# EAGLE design biosense_bgm220-pcbcart-cc-bma-flex-05212021 (EAGLE 9.3.1)
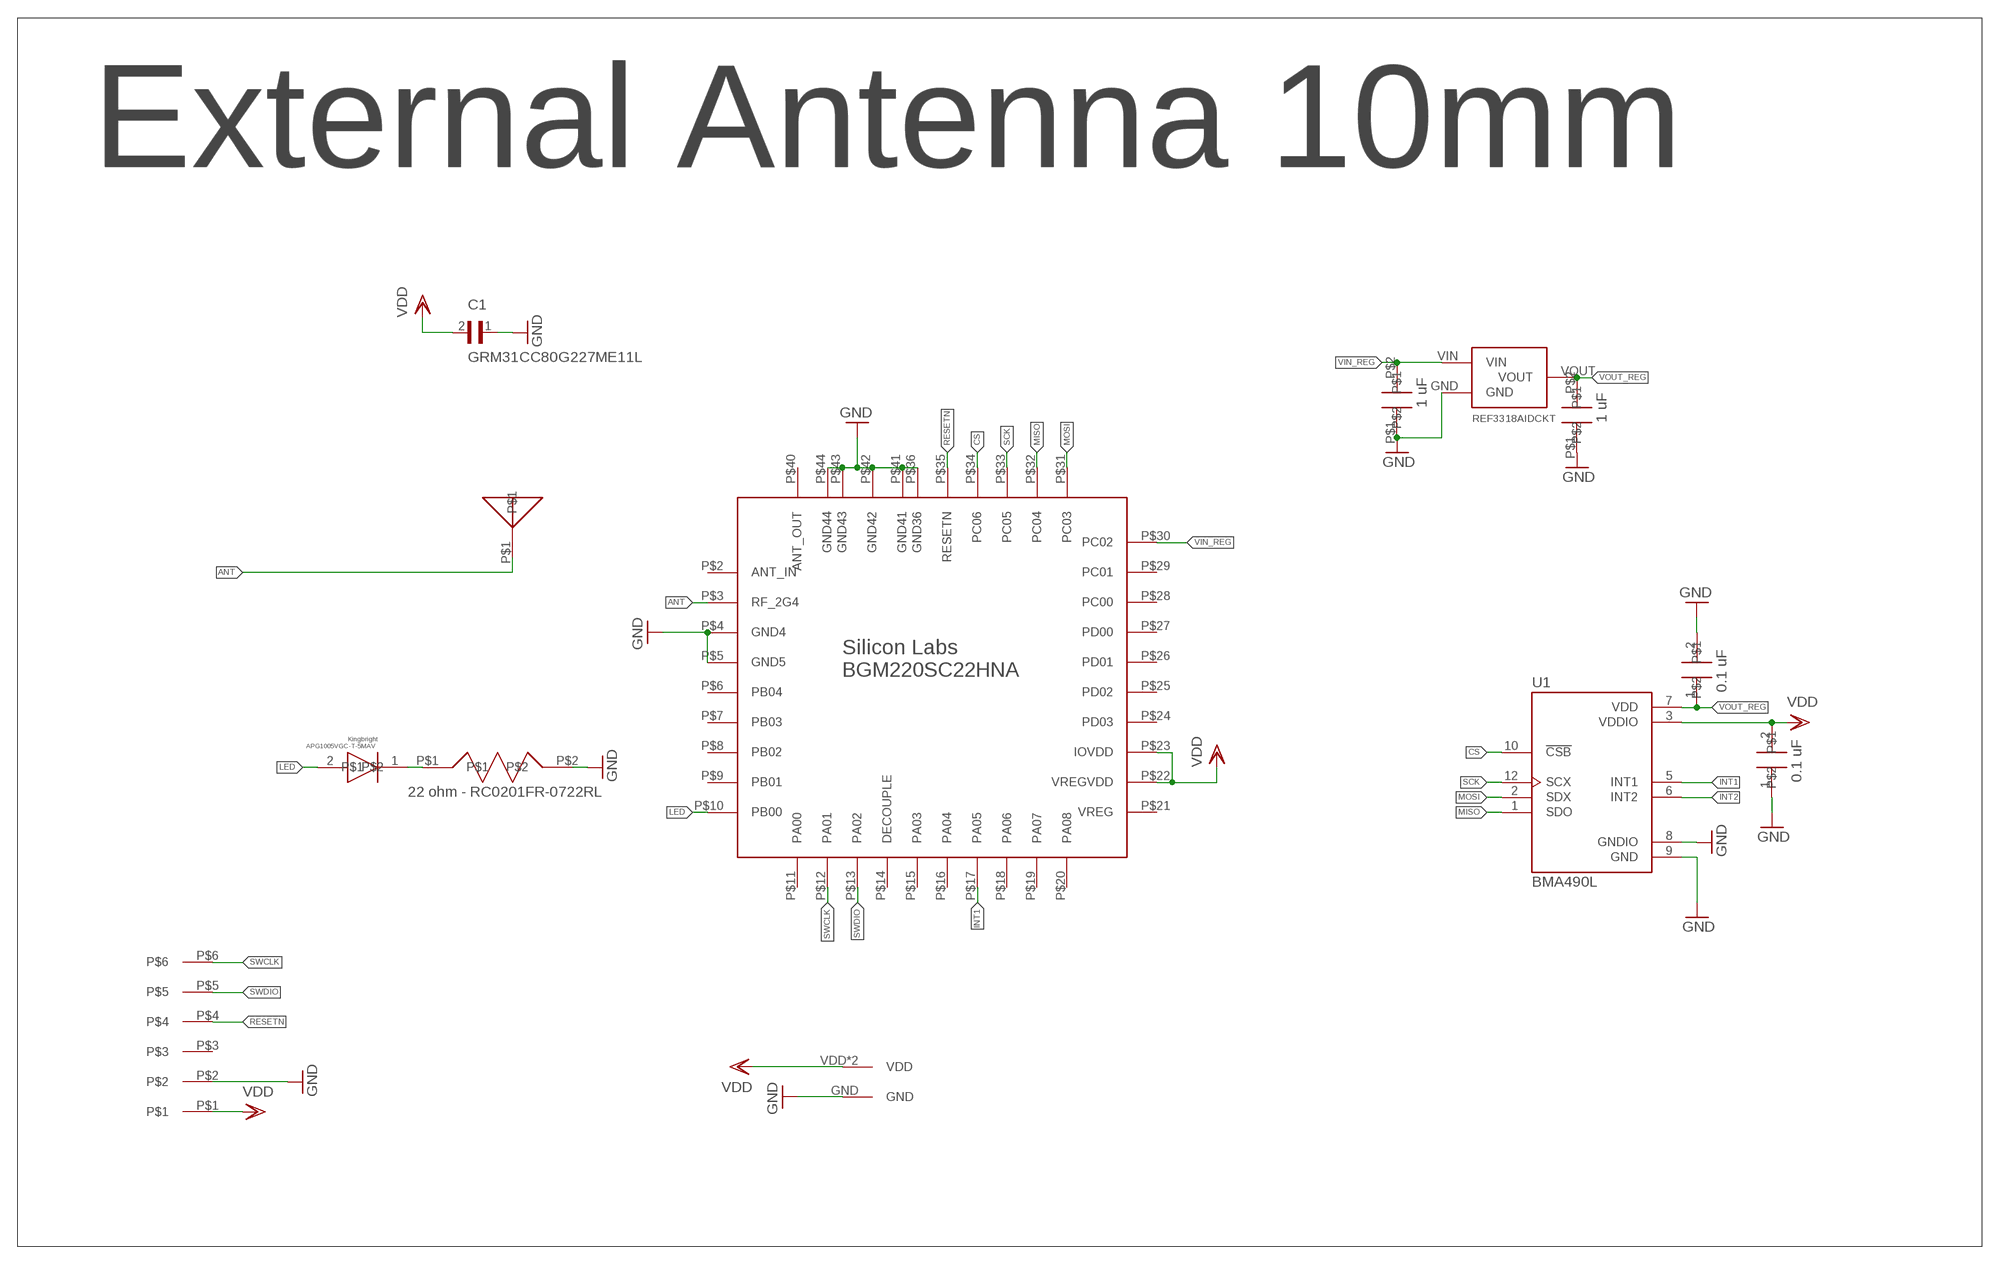
[diagram p0: schematic, sheet 1]

## Parts
C1  GRM31CC80G227ME11L  [CAP3216X125N]
R1  LEDRC0402N-L  [RC0402N-L]
U1  BMA490L  [BMA490L]
U$1  BGM220SC22HNA  [BGM220SC22HNA]
U$2  0U1_CAPACITOR  [FOOTPRINT_01005]
U$3  0U1_CAPACITOR  [FOOTPRINT_01005]
U$4  FPCHEADER  [FPCHEADER]
U$5  2450AT18A100  [2450AT18A100]
U$6  REF3318  [SOT-SC70]
U$7  CR1025HOLDERCR1025_3  [CR1025_3]
U$9  1U_CAPACITOR  [FOOTPRINT_0201]
U$10  1U_CAPACITOR  [FOOTPRINT_0201]
U$25  22OHMRESISTOR  [FOOTPRINT_0201]

## Nets
ANT: U$1.P$3(RF_2G4) U$5.P$1
CS: U1.10(!CSB) U$1.P$34(PC06)
GND: C1.1 U1.8(GNDIO) U1.9(GND) U$1.P$4(GND4) U$1.P$5(GND5) U$1.P$36(GND36) U$1.P$41(GND41) U$1.P$42(GND42) U$1.P$43(GND43) U$1.P$44(GND44) U$2.1 U$3.2 U$4.P$2 U$6.GND U$7.GND U$9.P$1 U$10.P$1 U$25.P$2
INT1: U1.5(INT1) U$1.P$17(PA05)
INT2: U1.6(INT2)
LED: R1.2 U$1.P$10(PB00)
MISO: U1.1(SDO) U$1.P$32(PC04)
MOSI: U1.2(SDX) U$1.P$31(PC03)
N$6: R1.1 U$25.P$1
RESETN: U$1.P$35(RESETN) U$4.P$4
SCK: U1.12(SCX) U$1.P$33(PC05)
SWCLK: U$1.P$12(PA01) U$4.P$6
SWDIO: U$1.P$13(PA02) U$4.P$5
VDD: C1.2 U1.3(VDDIO) U$1.P$22(VREGVDD) U$1.P$23(IOVDD) U$2.2 U$4.P$1 U$7.VDD U$7.VDD2(VDD)
VIN_REG: U$1.P$30(PC02) U$6.VIN U$9.P$2
VOUT_REG: U1.7(VDD) U$3.1 U$6.VOUT U$10.P$2
Unconnected: U$1.P$2(ANT_IN) U$1.P$6(PB04) U$1.P$7(PB03) U$1.P$8(PB02) U$1.P$9(PB01) U$1.P$11(PA00) U$1.P$14(DECOUPLE) U$1.P$15(PA03) U$1.P$16(PA04) U$1.P$18(PA06) U$1.P$19(PA07) U$1.P$20(PA08) U$1.P$21(VREG) U$1.P$24(PD03) U$1.P$25(PD02) U$1.P$26(PD01) U$1.P$27(PD00) U$1.P$28(PC00) U$1.P$29(PC01) U$1.P$40(ANT_OUT) U$4.P$3

## Notes on the sheet
- External Antenna 10mm

## Library data of the parts
C1 = BGM220S:GRM31CC80G227ME11L: CAP CER 220UF 4V X6S 1206; DESCRIPTION: 220µF ±20% 4V Ceramic Capacitor X6S 1206 _3216 Metric_; DIGI-KEY_PART_NUMBER: 490-13250-1-ND; DIGI-KEY_PURCHASE_URL: https://www.digikey.com/product-detail/en/murata-electronics/GRM31CC80G227ME11L/490-13250-1-ND/5877458?utm_source=snapeda&utm_medium=aggregator&utm_campaign=symbol; MF: Murata Electronics; MP: GRM31CC80G227ME11L; PACKAGE: 1206 Murata
R1 = BGM220S:LED; MANUFACTURER_PART_NUMBER: CRCW04020000Z0ED; VENDOR: Vishay
U1 = BGM220S:BMA490L: Ultra low power, 12-bit digital triaxial accelerometer; AVAILABILITY: Unavailable; DESCRIPTION: Accelerometer X, Y, Z Axis ±2g, 4g, 8g, 16g 12-LGA (2x2); MF: Bosch Sensortec; MP: BMA400; PACKAGE: LGA-12 Bosch Tools; PRICE: None
U$1 = BGM220S:BGM220SC22HNA: BGM220SC22HNA EFR32BG22 Series 2 Modules
U$2 U$3 = BGM220S:0U1_CAPACITOR: Murata Electronics GRM022R60J104KE15L 0.1μF ±10% 6.3V Ceramic Capacitor X5R 01005
U$4 = BGM220S:FPCHEADER
U$5 = BGM220S:2450AT18A100
U$6 = BGM220S:REF3318
U$7 = BGM220S:CR1025HOLDER
U$9 U$10 = BGM220S:1U_CAPACITOR: Samsung Electro-Mechanics CL03A105KQ3CSNC 1μF ±10% 6.3V Ceramic Capacitor X5R 0201
U$25 = BGM220S:22OHMRESISTOR: RC0201FR-0722RL

## Board
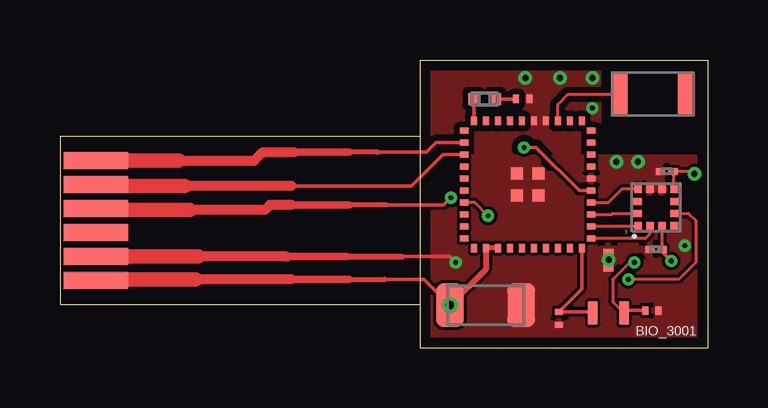
[diagram p1: board, top side]
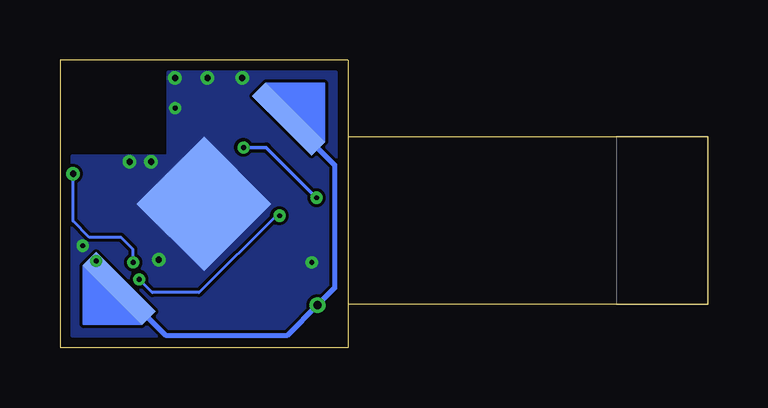
[diagram p2: board, bottom side, seen from below]

Size 27 x 12 mm. Coordinates in mm from the lower left corner, seen from the top.
Outline: 15,8.8 15,12 27,12 27,0 15,0 15,1.8
Outline: 15,8.8 0,8.8 0,1.8 15,1.8
Outline: 15,8.8 15,1.8
Copper layers (1*16): Top 0.035mm / dielectric 0.07mm / Bottom 0.035mm
Design rules "pcbcart_10-17-2020 *": minimum track width 5mil, minimum drill 0.2mm, track to track 5mil, track to pad 5mil, pad to pad 5mil, via to via 5mil, smd to smd 5mil, copper to edge 10mil, drill to drill 20mil, minimum pad ring 6mil, minimum via ring 6mil, stop-mask expansion 1mil, vias tented up to drill 50mil, thermal gap 10mil

### Footprints (pad centres in the part's own frame; a part is rotated, then mirrored left to right if it is on the bottom)
CAP3216X125N = smd 1.15 x 1.82: 1 -1.485,0; 2 1.485,0
RC0402N-L = smd 0.452 x 0.5: 1 -0.451,0; 2 0.451,0
BMA490L = smd 0.35 x 0.3: 1 -0.775,0.75; 2 -0.775,0.25; 3 -0.775,-0.25; 4 -0.775,-0.75; 7 0.775,-0.75; 8 0.775,-0.25; 9 0.775,0.25; 10 0.775,0.75 | smd 0.3 x 0.35: 5 -0.25,-0.775; 6 0.25,-0.775; 11 0.25,0.775; 12 -0.25,0.775
BGM220SC22HNA = smd 0.35 x 0.25: P$1 0,0; P$2 0,-0.5; P$3 0,-1; P$4 0,-1.5; P$5 0,-2; P$6 0,-2.5; P$7 0,-3; P$8 0,-3.5; P$9 0,-4; P$10 0,-4.5; P$21 5.3,-4.5; P$22 5.3,-4; P$23 5.3,-3.5; P$24 5.3,-3; P$25 5.3,-2.5; P$26 5.3,-2; P$27 5.3,-1.5; P$28 5.3,-1; P$29 5.3,-0.5; P$30 5.3,0 | smd 0.25 x 0.35: P$11 0.4,-4.9; P$12 0.9,-4.9; P$13 1.4,-4.9; P$14 1.9,-4.9; P$15 2.4,-4.9; P$16 2.9,-4.9; P$17 3.4,-4.9; P$18 3.9,-4.9; P$19 4.4,-4.9; P$20 4.9,-4.9; P$31 4.9,0.4; P$32 4.4,0.4; P$33 3.9,0.4; P$34 3.4,0.4; P$35 2.9,0.4; P$36 2.4,0.4; P$37 1.9,0.4; P$38 1.4,0.4; P$39 0.9,0.4; P$40 0.4,0.4 | smd 0.5 x 0.5: P$41 2.2,-1.8; P$42 2.2,-2.7; P$43 3.1,-2.7; P$44 3.1,-1.8
FOOTPRINT_01005 = smd 0.379 x 0.299: 1 -0.261,0; 2 0.261,0
FPCHEADER = smd 0.71 x 2.7: P$1 0,0; P$2 1,0; P$3 2,0; P$4 3,0; P$5 4,0; P$6 5,0
2450AT18A100 = smd 0.7 x 1.8: P$1 0.3,0.9; P$2 3.1,0.9
SOT-SC70 = smd 0.95 x 0.4: GND 2.2,0.65; VIN 0,1.3; VOUT 0,0
CR1025_3 = smd 3.96 x 3.96: GND 0,0 | smd 0.8 x 3.5: VDD -5,0; VDD2 5,0
FOOTPRINT_0201 = smd 0.25 x 0.35: P$1 0,0; P$2 0.55,0

### Placement (x,y rotation side)
C1  17.75,1.77 180 top
R1  17.7,10.37 180 top
U1  24.85,5.85 90 top
U$1  21.75,9.45 270 top
U$2  24.85,4.1 0 top
U$3  25.3,7.35 180 top
U$4  1.5,2.8 90 top
U$5  23.01,9.67 0 top
U$6  23.51,1.45 90 top
U$7  21,6 45 bottom
U$9  20.8,0.95 90 top
U$10  24.95,1.55 180 top
U$25  19.02,10.37 0 top

### Tracks (layer width: path | path; a pad name or v marks a point on that pad's centre or on a via)
ANT
  Top 0.127: U$1.P$3 20.75,10.14 21.18,10.57 U$5.P$1
CS
  Top 0.127: U1.10 23.43,6.62 22.86,6.05 U$1.P$34
GND  (via drill 0.2, 0.25)
  Top 0.152: 14.25,3.8 16.25,3.8 v16.5,3.55
  Top 0.254: 11.95,3.8 14.25,3.8
  Top 0.305: 11.95,3.8 9.45,3.8
  Top 0.406: 9.45,3.8 5.75,3.8
  Top 0.61: 5.75,3.8 U$4.P$2
  other vias: 19.4,11.25 20.85,11.25 22.2,11.25 22.2,9.99 24.1,7.75 23.2,7.75 22.88,3.67 26.05,4.25
  pour Top (isolate 0.254, no thermals): 15.5,0.5 15.5,11.5 22.5,11.5 22.5,8 26.5,8 26.5,0.5
  pour Bottom (no thermals): 15.5,0.5 15.5,11.5 22.5,11.5 22.5,8 26.5,8 26.5,0.5
  pour Top: 26.5,8 26.5,0.5 26.35,0.5 15.5,0.5 15.5,8
INT1  (via drill 0.2)
  Top 0.127: U1.5 26.2,5.6 26.5,5.3 26.5,3.55 25.8,2.85 v23.7,2.85 | U$1.P$17 17.3,6.05 v17.85,5.5
  Bottom 0.127: v17.85,5.5 18,5.5 21.2,2.3 23.15,2.3 v23.7,2.85
LED
  Top 0.152: U$1.P$10 R1.2
MISO
  Top 0.127: U1.1 24.08,5.05 U$1.P$32
MOSI
  Top 0.127: U1.2 24.6,4.75 24.4,4.55 U$1.P$31
N$6
  Top 0.152: R1.1 U$25.P$1
RESETN  (via drill 0.2)
  Top 0.152: U$1.P$35 21.65,6.55 19.85,8.35 v19.35,8.35 | v16.3,6.25 16,5.95 13.6,5.95
  Top 0.203: 13.6,5.95 12.05,5.95
  Top 0.305: 12.05,5.95 9.65,5.95
  Top 0.406: 9.65,5.95 8.75,5.95 8.55,5.75 5.4,5.75
  Top 0.61: 5.4,5.75 1.55,5.75 U$4.P$4
  Bottom 0.152: v16.3,6.25 18.4,8.35 v19.35,8.35
SCK
  Top 0.127: U$1.P$33 23,5.55 23.05,5.6 U1.12
SWCLK
  Top 0.152: U$1.P$12 15.68,8.55 15.28,8.15 13.25,8.15
  Top 0.203: 13.25,8.15 12.05,8.15
  Top 0.305: 9.75,8.15 12.05,8.15
  Top 0.406: 4.95,7.8 8.1,7.8 8.45,8.15 9.75,8.15
  Top 0.61: U$4.P$6 4.95,7.8
SWDIO
  Top 0.152: U$1.P$13 15.96,8.05 14.66,6.75 9.65,6.75
  Top 0.406: 9.65,6.75 5.2,6.75
  Top 0.61: 5.2,6.75 1.55,6.75 U$4.P$5
VDD  (via drill 0.2, 0.35)
  Top 0.127: U1.3 U$2.2
  Top 0.152: 13.55,2.85 15.19,2.85 C1.2 | U$2.2 25.11,3.99 v25.49,3.61
  Top 0.203: U$1.P$23 U$1.P$22 | 12.05,2.85 13.55,2.85
  Top 0.254: U$1.P$22 17.75,3.26 C1.2
  Top 0.305: 12.05,2.85 9.65,2.85
  Top 0.406: 9.65,2.85 5.65,2.85
  Top 0.61: 5.65,2.85 1.55,2.85 U$4.P$1
  Bottom 0.152: U$7.VDD 25.49,3.42 v25.49,3.61
  Bottom 0.203: U$7.VDD 22.57,0.5 17.54,0.5 C1.2 15.55,2.48 15.55,7.62 U$7.VDD2
  other vias: 16.26,1.77
VIN_REG
  Top 0.152: U$1.P$30 21.75,2.45 U$9.P$2 22.16,1.5 U$6.VIN
VOUT_REG  (via drill 0.2, 0.25)
  Top 0.127: U1.7 25.6,7.31 U$3.1 26.35,7.35 v26.45,7.25 | v23.95,3.55 23.75,3.55 23.05,2.85 23.05,1.91 U$6.VOUT
  Top 0.152: U$10.P$2 23.62,1.55 U$6.VOUT
  Bottom 0.127: v23.95,3.55 23.95,4.1 24.45,4.6 25.77,4.6 26.45,5.28 v26.45,7.25

### Text on the board
tPlace: BIO_3001